# EAGLE design cross (EAGLE 9.5.2)
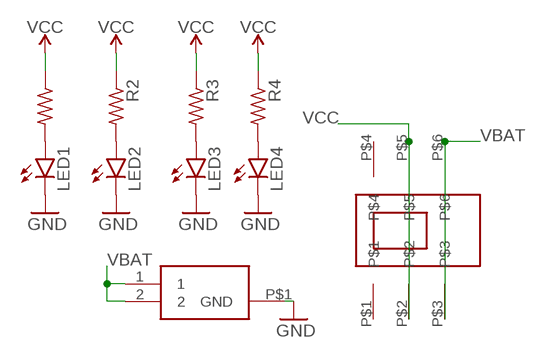
[diagram p0: schematic, sheet 1]

## Parts
LED1  LEDCHIP-LED0805  [CHIP-LED0805]
LED2  LEDCHIP-LED0805  [CHIP-LED0805]
LED3  LEDCHIP-LED0805  [CHIP-LED0805]
LED4  LEDCHIP-LED0805  [CHIP-LED0805]
R1  R-US_R0603  [R0603]
R2  R-US_R0603  [R0603]
R3  R-US_R0603  [R0603]
R4  R-US_R0603  [R0603]
U$1  CL-SB-22A-02T-SLIDE-SWITCH-TUCKED-PADS  [CL-SB-22A-02T-DPDT-COMPACT-SWITCH]
VBAT  BAT-HLD-012-SMT  [BATHLD012SMT]

## Nets
GND: LED1.C LED2.C LED3.C LED4.C VBAT.P$1(GND)
N$1: LED1.A R1.2
N$2: LED2.A R2.2
N$3: LED3.A R3.2
N$4: LED4.A R4.2
VBAT: U$1.P$3 U$1.P$6 VBAT.1 VBAT.2
VCC: R1.1 R2.1 R3.1 R4.1 U$1.P$2 U$1.P$5
Unconnected: U$1.P$1 U$1.P$4

## Library data of the parts
LED1-LED4 = led:LED: LED OSRAM: - CHIPLED LG R971, LG N971, LY N971, LG Q971, LY Q971, LO R971, LY R971 LH N974, LH R974 LS Q976, LO Q976, LY Q976 LO Q996 - Hyper CHIPLED LW Q18S LB Q993, LB Q99A, LB R99A - SideLED LS A670, LO A670, LY A670, LG A670, LP A670 LB A673, LV A673, LT A673, LW A673 LH A674 LY A675 LS A676, LA A676, LO A676, LY A676, LW A676 LS A679, LY A679, LG A679 - Hyper Micro SIDELED® LS Y876, LA Y876, LO Y876, LY Y876 LT Y87S - SmartLED LW L88C, LW L88S LB L89C, LB L89S, LG L890 LS L89K, LO L89K, LY L89K LS L896, LA L896, LO L896, LY L896 - TOPLED LS T670, LO T670, LY T670, LG T670, LP T670 LSG T670, LSP T670, LSY T670, LOP T670, LYG T670 LG T671, LOG T671, LSG T671 LB T673, LV T673, LT T673, LW T673 LH T674 LS T676, LA T676, LO T676, LY T676, LB T676, LH T676, LSB T676, LW T676 LB T67C, LV T67C, LT T67C, LS T67K, LO T67K, LY T67K, LW E67C LS E67B, LA E67B, LO E67B, LY E67B, LB E67C, LV E67C, LT E67C LW T67C LS T679, LY T679, LG T679 LS T770, LO T770, LY T770, LG T770, LP T770 LB T773, LV T773, LT T773, LW T773 LH T774 LS E675, LA E675, LY E675, LS T675 LS T776, LA T776, LO T776, LY T776, LB T776 LHGB T686 LT T68C, LB T68C - Hyper Mini TOPLED® LB M676 - Mini TOPLED Santana® LG M470 LS M47K, LO M47K, LY M47K Source: http://www.osram.convergy.de LUXEON: - LUMILED® LXK2-PW12-R00, LXK2-PW12-S00, LXK2-PW14-U00, LXK2-PW14-V00 LXK2-PM12-R00, LXK2-PM12-S00, LXK2-PM14-U00 LXK2-PE12-Q00, LXK2-PE12-R00, LXK2-PE12-S00, LXK2-PE14-T00, LXK2-PE14-U00 LXK2-PB12-K00, LXK2-PB12-L00, LXK2-PB12-M00, LXK2-PB14-N00, LXK2-PB14-P00, LXK2-PB14-Q00 LXK2-PR12-L00, LXK2-PR12-M00, LXK2-PR14-Q00, LXK2-PR14-R00 LXK2-PD12-Q00, LXK2-PD12-R00, LXK2-PD12-S00 LXK2-PH12-R00, LXK2-PH12-S00 LXK2-PL12-P00, LXK2-PL12-Q00, LXK2-PL12-R00 Source: www.luxeon.com KINGBRIGHT: KA-3528ASYC Source: www.kingbright.com
R1-R4 = rcl:R-US_: RESISTOR, American symbol; SPICEPREFIX: R
U$1 = electroninks:CL-SB-22A-02T-SLIDE-SWITCH-TUCKED-PADS
VBAT = SamacSys_Parts:BAT-HLD-012-SMT: Coin Cell Battery Holders Bat Hld CR1216/1225 Surface Mount Source: Datasheet <https://componentsearchengine.com/Datasheets/1/BAT-HLD-012-SMT.pdf>; DESCRIPTION: Coin Cell Battery Holders Bat Hld CR1216/1225 Surface Mount; HEIGHT: 3mm; MANUFACTURER_NAME: Linx Technologies; MANUFACTURER_PART_NUMBER: BAT-HLD-012-SMT; MOUSER_PART_NUMBER: 712-BAT-HLD-012-SMT; MOUSER_PRICE-STOCK: https://www.mouser.com/Search/Refine.aspx?Keyword=712-BAT-HLD-012-SMT

## Board
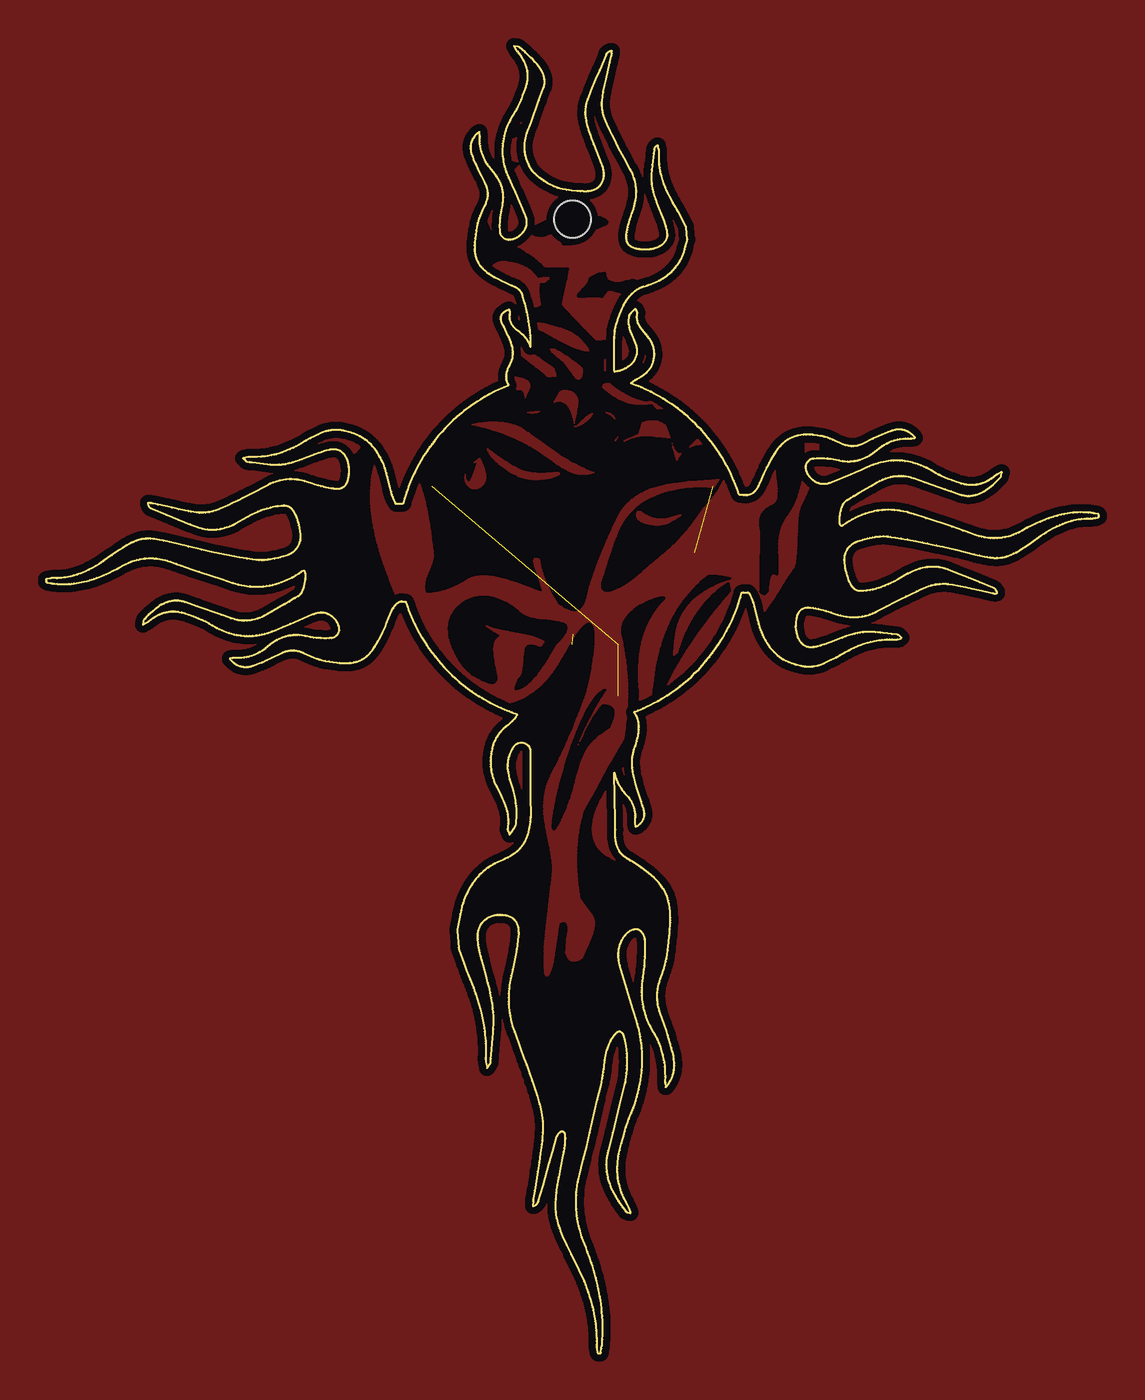
[diagram p1: board, top side]
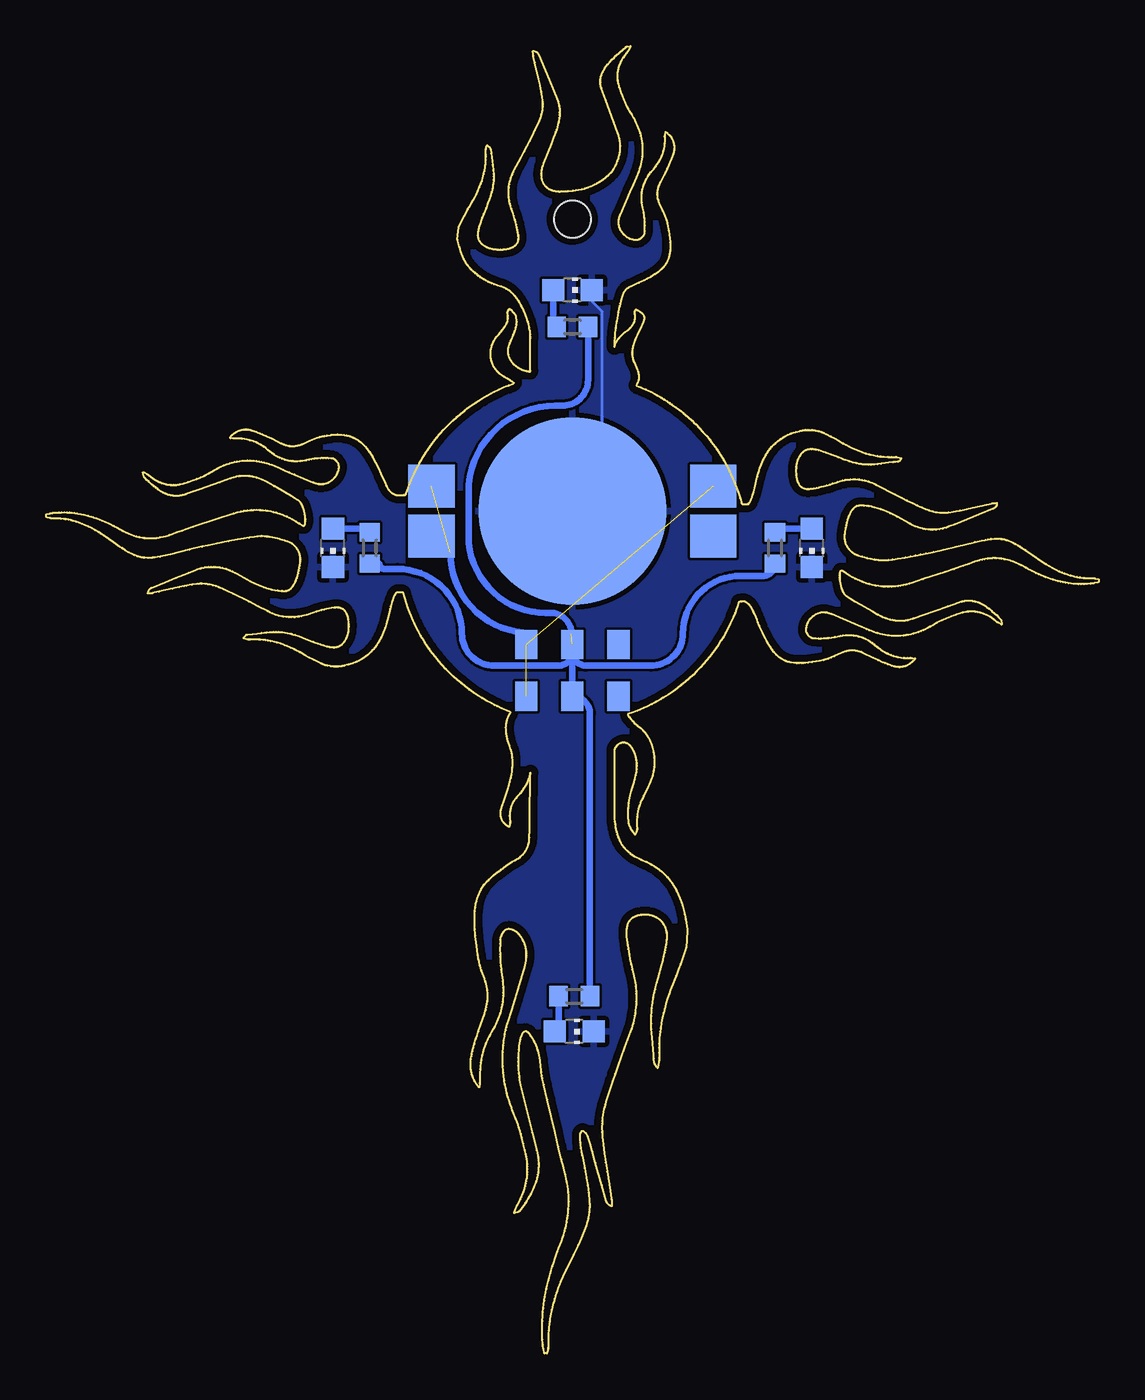
[diagram p2: board, bottom side, seen from below]

Size 57.15 x 71 mm. Coordinates in mm from the lower left corner, seen from the top.
Outline: 3548 segments
Copper layers (1*16): Top 0.035559375mm / dielectric 1.6mm / Bottom 0.035559375mm
Design rules "oshpark-2layer": minimum track width 6mil, minimum drill 10mil, track to track 6mil, track to pad 6mil, pad to pad 6mil, via to via 6mil, smd to smd 6mil, copper to edge 15mil, drill to drill 6mil, minimum pad ring 5mil, minimum via ring 5mil, stop-mask expansion 2.5mil, vias tented up to drill 0mil, thermal gap 10mil
Holes 2 mm at 28.57,61.6
tRestrict: area 25.1,56.4 to 25.2,56.6; area 25.1,56.4 to 25.2,56.6; area 25.1,56.6 to 25.2,56.7; area 25.1,56.6 to 25.2,56.7; area 25,56.6 to 25.1,56.7; area 25,56.6 to 25.1,56.7; area 24.8,56.4 to 25.1,56.6; area 24.8,56.4 to 25.1,56.6; area 27.9,61.2 to 28.7,61.8; area 27.9,61.2 to 28.7,61.8; area 26.1,60.8 to 26.5,61.2; area 26.1,60.8 to 26.5,61.2; 1107 more areas

### Footprints (pad centres in the part's own frame; a part is rotated, then mirrored left to right if it is on the bottom)
CHIP-LED0805 = smd 1.2 x 1.2: A 0,-1.05; C 0,1.05
R0603 = smd 1 x 1.1: 1 -0.85,0; 2 0.85,0
CL-SB-22A-02T-DPDT-COMPACT-SWITCH = smd 1.2 x 1.6: P$1 -2.5,-1.4; P$2 0,-1.4; P$3 2.5,-1.4; P$4 -2.5,1.4; P$5 0,1.4; P$6 2.5,1.4
BATHLD012SMT = smd 2.5 x 2.325: 1 -7.65,1.35; 2 7.65,1.35; P$2 -7.65,-1.35; P$3 7.65,-1.35 | smd 10.2 x 10.2: P$1 0,0

### Placement (x,y rotation side)
LED1  15.57,43.75 180 bottom
LED2  41.57,43.75 180 bottom
LED3  28.47,17.49 270 bottom
LED4  28.57,57.75 270 bottom
R1  17.57,43.75 90 bottom
R2  39.57,43.75 90 bottom
R3  28.47,19.4 180 bottom
R4  28.57,55.75 180 bottom
U$1  28.57,37.1 180 bottom
VBAT  28.57,45.75 0 bottom

### Tracks (layer width: path | path; a pad name or v marks a point on that pad's centre or on a via)
GND
  Bottom 0.152: LED4.C 27.52,57.15 26.97,56.6 26.97,47.35 VBAT.P$1
  pour Bottom (rank 3): -6.43,-6.9 -6.43,83.1 53.57,83.1 63.57,83.1 63.57,-6.9
  pour Top (rank 3): -6.43,-6.9 -6.43,83.1 63.57,83.1 63.57,-6.9
N$1
  Bottom 0.35: LED1.A 17.37,44.8 arc-90 R1.2
N$2
  Bottom 0.35: R2.2 arc-90 39.77,44.8 LED2.A
N$3
  Bottom 0.35: LED3.A arc-90 29.32,17.69 R3.2
N$4
  Bottom 0.35: LED4.A 29.62,55.95 arc-90 R4.2
VBAT  (3 unrouted)
  Bottom 0.35: U$1.P$3 30.86,38.71 30.86,39.13 arc90 35.21,43.48
VCC  (1 unrouted)
  Bottom 0.35: 28.57,38.1 arc90 29.32,37.35 32.83,37.35 arc90 34.57,39.1 arc-90 38.08,42.61 38.78,42.61 arc90 39.07,42.9 R2.1 | 28.57,38.1 U$1.P$2 U$1.P$5 arc90 27.62,34.75 R3.1 | 28.57,38.1 arc-90 27.83,37.35 24.32,37.35 arc-90 22.57,39.1 arc90 19.45,42.23 18.24,42.23 arc-90 R1.1 | R4.1 27.72,52.87 arc90 29.13,51.46 29.52,51.46 arc-90 34.21,46.77 34.21,44.41 arc-90 30.02,40.22 29.77,40.22 arc90 28.63,39.07